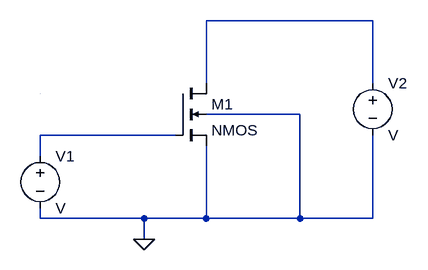
[diagram p0: schematic Draft1.asc]
Draft1.asc, the LTspice schematic file:
Version 4
SHEET 1 880 680
WIRE 512 -112 256 -112
WIRE 256 -16 256 -112
WIRE 512 -16 512 -112
WIRE 400 32 256 32
WIRE 208 64 0 64
WIRE 0 96 0 64
WIRE 0 192 0 176
WIRE 160 192 0 192
WIRE 256 192 256 80
WIRE 256 192 160 192
WIRE 400 192 400 32
WIRE 400 192 256 192
WIRE 512 192 512 64
WIRE 512 192 400 192
WIRE 160 224 160 192
WIRE 0 0 0 0
FLAG 160 224 0
SYMBOL voltage 0 80 R0
SYMATTR InstName V1
SYMBOL nmos4 208 -16 R0
SYMATTR InstName M1
SYMBOL voltage 512 -32 R0
SYMATTR InstName V2

The netlist it stands for:
* Draft1.asc
V1 N002 0 V
M1 N001 N002 0 0 NMOS
V2 N001 0 V
.model NMOS NMOS
.model PMOS PMOS
.lib standard.mos
.backanno
.end